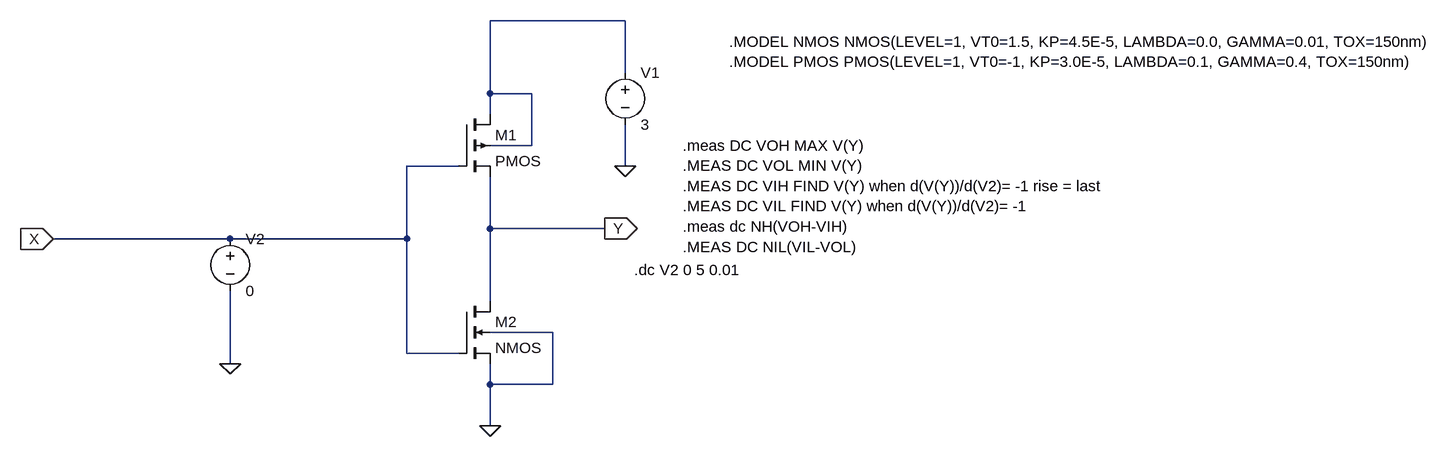
[diagram p0: schematic IV-cmos.asc]
IV-cmos.asc, the LTspice schematic file:
Version 4
SHEET 1 1956 680
WIRE 672 -192 464 -192
WIRE 672 -112 672 -192
WIRE 464 -80 464 -192
WIRE 528 -80 464 -80
WIRE 464 -48 464 -80
WIRE 528 0 528 -80
WIRE 528 0 464 0
WIRE 416 32 336 32
WIRE 672 32 672 -32
WIRE 464 128 464 48
WIRE 640 128 464 128
WIRE 64 144 -208 144
WIRE 336 144 336 32
WIRE 336 144 64 144
WIRE 464 240 464 128
WIRE 560 288 464 288
WIRE 336 320 336 144
WIRE 416 320 336 320
WIRE 64 336 64 224
WIRE 464 368 464 336
WIRE 560 368 560 288
WIRE 560 368 464 368
WIRE 464 432 464 368
FLAG 64 336 0
FLAG 464 432 0
FLAG 672 32 0
FLAG 640 128 Y
IOPIN 640 128 Out
FLAG -208 144 X
IOPIN -208 144 In
SYMBOL voltage 64 128 R0
SYMATTR InstName V2
SYMATTR Value 0
SYMBOL voltage 672 -128 R0
SYMATTR InstName V1
SYMATTR Value 3
SYMBOL pmos4 416 -48 R0
SYMATTR InstName M1
SYMBOL nmos4 416 240 R0
SYMATTR InstName M2
TEXT 832 -160 Left 2 !.MODEL NMOS NMOS(LEVEL=1, VT0=1.5, KP=4.5E-5, LAMBDA=0.0, GAMMA=0.01, TOX=150nm)\n.MODEL PMOS PMOS(LEVEL=1, VT0=-1, KP=3.0E-5, LAMBDA=0.1, GAMMA=0.4, TOX=150nm)
TEXT 760 0 Left 2 !.meas DC VOH MAX V(Y)\n.MEAS DC VOL MIN V(Y)\n.MEAS DC VIH FIND V(Y) when d(V(Y))/d(V2)= -1 rise = last\n.MEAS DC VIL FIND V(Y) when d(V(Y))/d(V2)= -1\n.meas dc NH(VOH-VIH)\n.MEAS DC NIL(VIL-VOL)
TEXT 686 192 Left 2 !.dc V2 0 5 0.01

The netlist it stands for:
* IV-cmos.asc
V2 X 0 0
V1 N001 0 3
M1 N001 X Y N001 PMOS
M2 Y X 0 0 NMOS
.model NMOS NMOS
.model PMOS PMOS
.lib standard.mos
.MODEL NMOS NMOS(LEVEL=1, VT0=1.5, KP=4.5E-5, LAMBDA=0.0, GAMMA=0.01, TOX=150nm)
.MODEL PMOS PMOS(LEVEL=1, VT0=-1, KP=3.0E-5, LAMBDA=0.1, GAMMA=0.4, TOX=150nm)
.meas DC VOH MAX V(Y)
.MEAS DC VOL MIN V(Y)
.MEAS DC VIH FIND V(Y) when d(V(Y))/d(V2)= -1 rise = last
.MEAS DC VIL FIND V(Y) when d(V(Y))/d(V2)= -1
.meas dc NH(VOH-VIH)
.MEAS DC NIL(VIL-VOL)
.dc V2 0 5 0.01
.backanno
.end

* Results of the author's LTspice run, read from the files saved beside the schematic
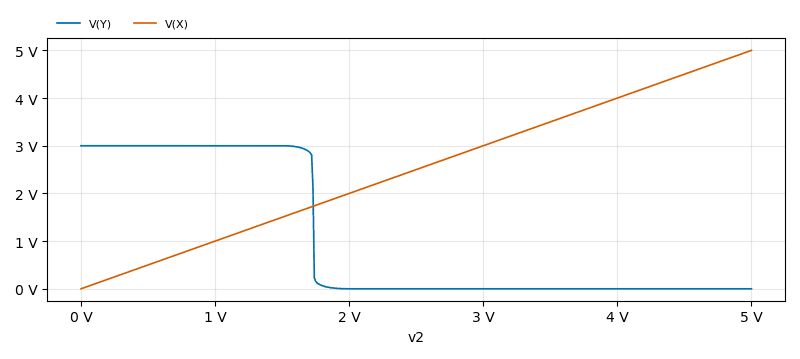
[diagram p1: DC transfer characteristic of IV-cmos.asc, plotted from the saved traces]
* DC transfer characteristic, 1 run:
*   V(Y): 3 V at v2=0 V, 38.16 nV at v2=5 V, min 38.16 nV, max 3 V
*   V(X): 0 V at v2=0 V, 5 V at v2=5 V, min 0 V, max 5 V
* From the log:
*   voh: MAX(v(y))=3 FROM 0 TO 5
*   vol: MIN(v(y))=3.81587e-008 FROM 0 TO 5
*   vih: v(y)=0.06433 at 1.80007
*   vil: v(y)=2.93918 at 1.65909
*   nh(voh-vih)=5 FROM 0 TO 5
*   nil(vil-vol)=5 FROM 0 TO 5